# EAGLE design djesaac (EAGLE 8.1.1)
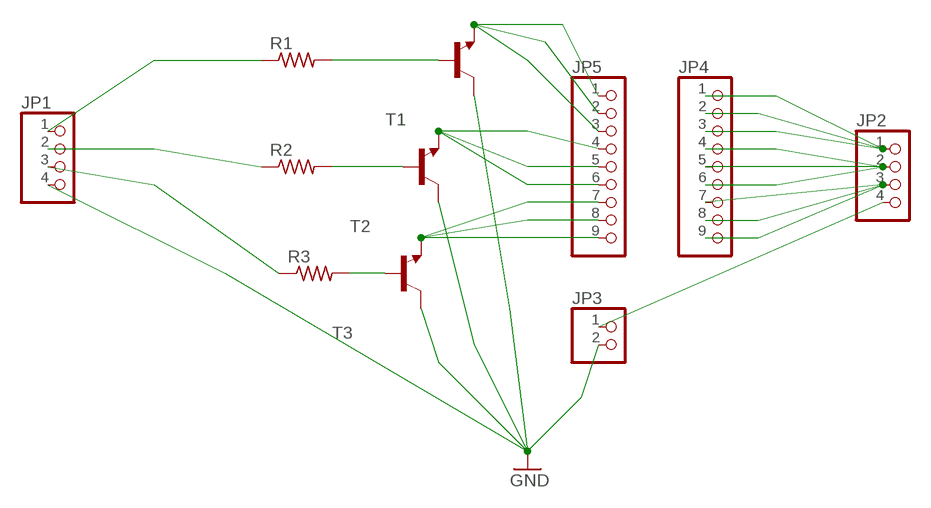
[diagram p0: schematic, sheet 1]

## Parts
JP1  PINHD-1X4  [1X04]
JP2  PINHD-1X4  [1X04]
JP3  PINHD-1X2  [1X02]
JP4  PINHD-1X9  [1X09]
JP5  PINHD-1X9  [1X09]
R1  R-US_0207/10  [0207/10]
R2  R-US_0207/10  [0207/10]
R3  R-US_0207/10  [0207/10]
T1  -NPN-TO92-CBE  [TO92-CBE]
T2  -NPN-TO92-CBE  [TO92-CBE]
T3  -NPN-TO92-CBE  [TO92-CBE]

## Nets
GND: JP1.4 JP3.2 T1.C T2.C T3.C
N$1: JP1.1 R1.1
N$2: JP1.2 R2.1
N$3: JP1.3 R3.1
N$4: JP2.4 JP3.1
N$5: R1.2 T1.B
N$6: R2.2 T2.B
N$7: R3.2 T3.B
N$8: JP5.1 JP5.2 JP5.3 T1.E
N$9: JP5.4 JP5.5 JP5.6 T2.E
N$10: JP5.7 JP5.8 JP5.9 T3.E
N$11: JP2.1 JP4.1 JP4.2 JP4.3
N$12: JP2.2 JP4.4 JP4.5 JP4.6
N$13: JP2.3 JP4.7 JP4.8 JP4.9

## Library data of the parts
JP1 JP2 = pinhead:PINHD-1X4: PIN HEADER
JP3 = pinhead:PINHD-1X2: PIN HEADER
JP4 JP5 = pinhead:PINHD-1X9: PIN HEADER
R1-R3 = resistor:R-US_: RESISTOR, American symbol
T1-T3 = transistor-neu-to92:*-NPN-: NPN Transistror

## Board
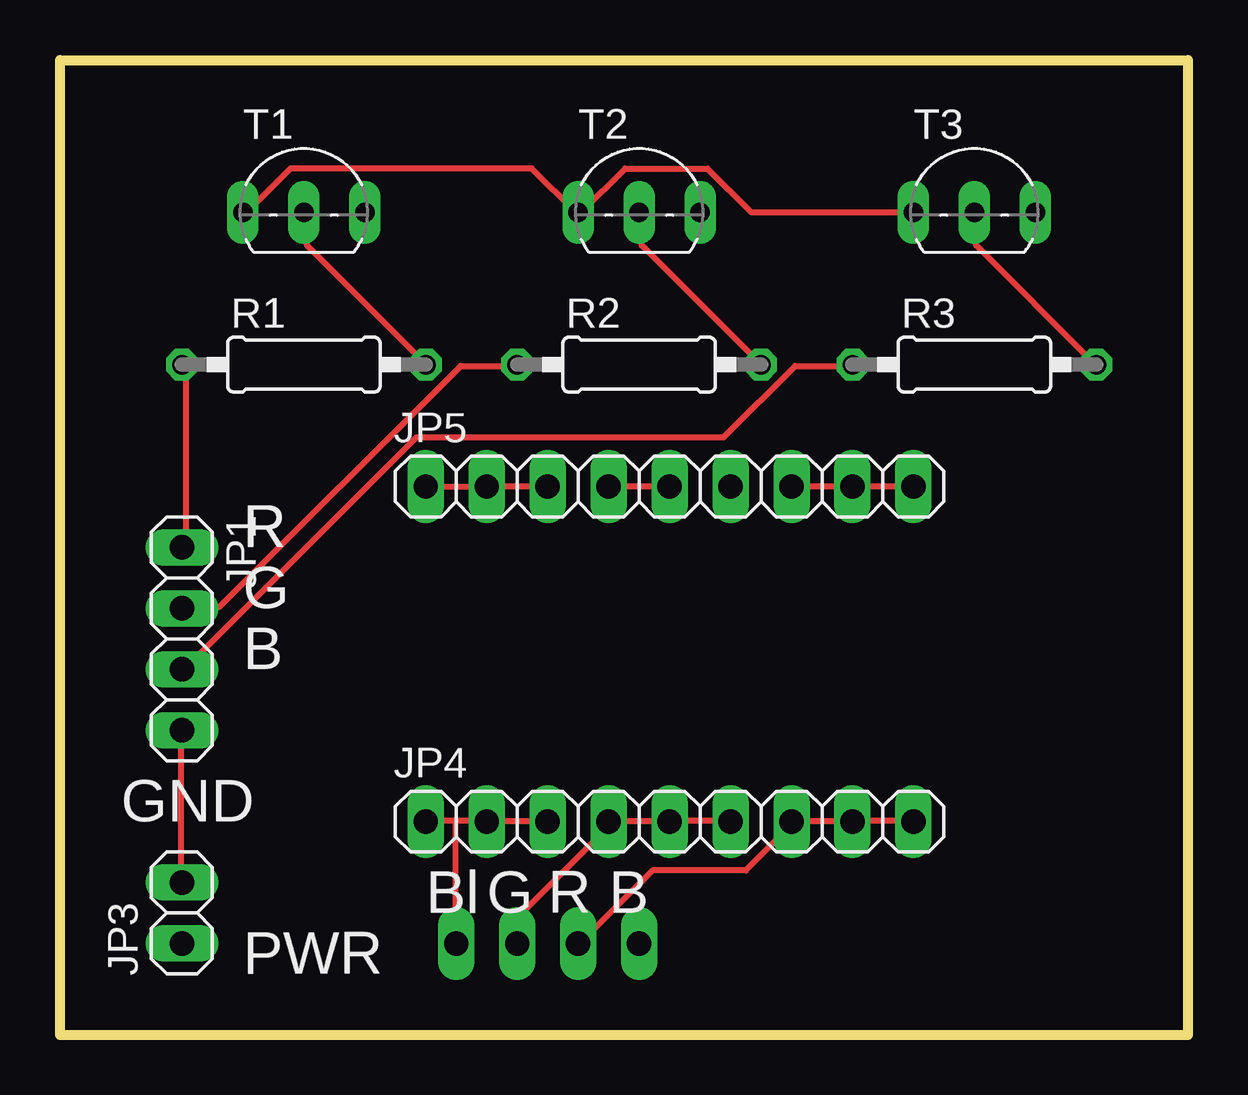
[diagram p1: board, top side]
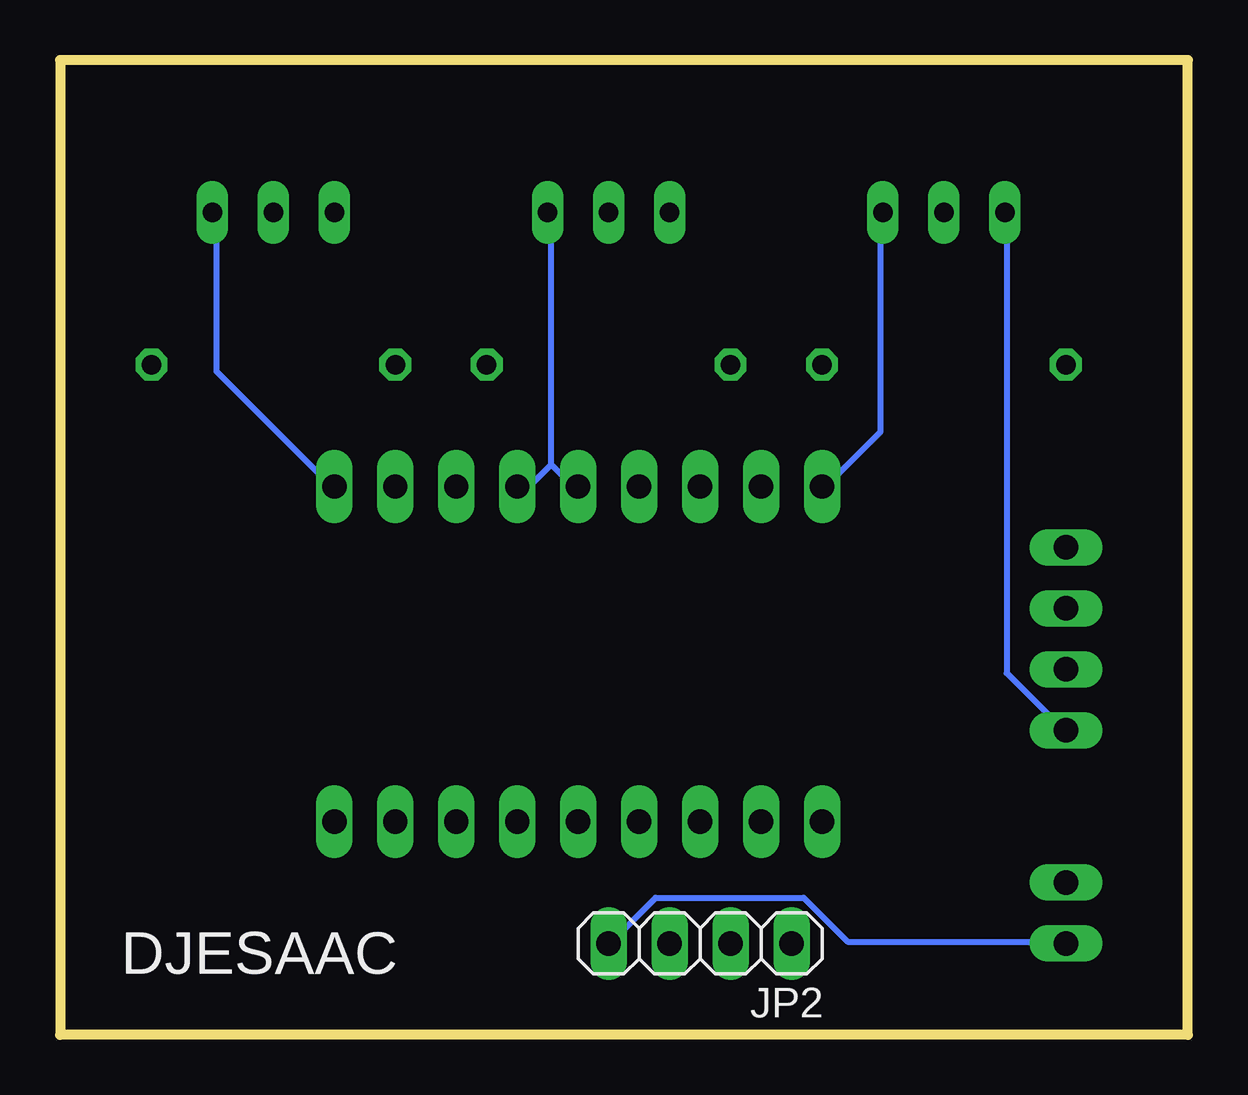
[diagram p2: board, bottom side, seen from below]

Size 46.99 x 40.64 mm. Coordinates in mm from the lower left corner, seen from the top.
Outline: 0,0 0,40.64 46.99,40.64 46.99,0 0,0
Copper layers (1*16): Top 0.035mm / dielectric 1.5mm / Bottom 0.035mm
Design rules "default": minimum track width 10mil, minimum drill 24mil, track to track 8mil, track to pad 8mil, pad to pad 8mil, via to via 8mil, smd to smd 8mil, copper to edge 40mil, drill to drill 8mil, minimum pad ring 10mil, minimum via ring 8mil, stop-mask expansion 4mil, vias tented up to drill 0mil, thermal gap 10mil

### Footprints (pad centres in the part's own frame; a part is rotated, then mirrored left to right if it is on the bottom)
1X04 = drill 1.016 long: 1 -3.81,0; 2 -1.27,0; 3 1.27,0; 4 3.81,0
1X02 = drill 1.016 long: 1 -1.27,0; 2 1.27,0
1X09 = drill 1.016 long: 1 -10.16,0; 2 -7.62,0; 3 -5.08,0; 4 -2.54,0; 5 0,0; 6 2.54,0; 7 5.08,0; 8 7.62,0; 9 10.16,0
0207/10 = drill 0.813 octagon: 1 -5.08,0; 2 5.08,0
TO92-CBE = drill 0.813 long: B 0,0; C -2.54,0; E 2.54,0

### Placement (x,y rotation side)
JP1  5.08,16.51 270 top
JP2  20.32,3.81 180 bottom
JP3  5.08,5.08 90 top
JP4  25.4,8.89 0 top
JP5  25.4,22.86 0 top
R1  10.16,27.94 0 top
R2  24.13,27.94 0 top
R3  38.1,27.94 0 top
T1  10.16,34.29 0 top
T2  24.13,34.29 0 top
T3  38.1,34.29 0 top

### Tracks (layer width: path | path; a pad name or v marks a point on that pad's centre or on a via)
GND
  Top 0.254: JP3.2 5.03,6.4 5.03,12.57 JP1.4 | T1.C 7.77,34.29 9.6,36.12 19.66,36.12 21.49,34.29 T2.C 21.72,34.29 23.55,36.12 26.98,36.12 28.8,34.29 T3.C
  Bottom 0.254: JP1.4 5.26,12.8 7.54,15.09 7.54,34.29 T1.C
N$1
  Top 0.254: R1.1 5.26,27.89 5.26,20.34 JP1.1
N$2
  Top 0.254: R2.1 18.97,27.89 16.69,27.89 6.63,17.83 5.26,17.83 JP1.2
N$3
  Top 0.254: R3.1 32.92,27.89 30.63,27.89 27.66,24.92 14.86,24.92 5.26,15.32 JP1.3
N$4
  Bottom 0.254: JP3.1 5.26,3.89 14.17,3.89 16,5.71 22.17,5.71 24,3.89 JP2.4
N$5
  Top 0.254: T1.B 10.29,34.29 10.29,32.92 15.09,28.12 R1.2
N$6
  Top 0.254: R2.2 24.23,32.92 24.23,34.29 T2.B
N$7
  Top 0.254: T3.B 38.18,34.29 38.18,32.92 42.98,28.12 R3.2
N$8
  Top 0.254: JP5.3 JP5.2 JP5.1
  Bottom 0.254: T1.E 12.8,34.29 12.8,25.15 15.09,22.86 JP5.1
N$9
  Top 0.254: JP5.5 JP5.4
  Bottom 0.254: 26.52,23.77 26.52,34.29 T2.E | 26.52,23.77 25.6,22.86 JP5.5 | JP5.6 27.43,22.86 26.52,23.77
N$10
  Top 0.254: JP5.7 JP5.8 JP5.9
  Bottom 0.254: T3.E 40.46,34.29 40.46,27.66 35.66,22.86 JP5.9
N$11
  Top 0.254: 16.46,8.91 17.6,8.91 JP4.2 17.83,8.91 20.12,8.91 JP4.3 | 16.46,8.91 15.32,8.91 JP4.1 | 16.46,8.91 16.46,3.89 JP2.1
N$12
  Top 0.254: JP4.6 27.89,8.91 25.6,8.91 JP4.5 25.38,8.91 22.86,8.91 JP4.4 22.86,8.69 19.2,5.03 19.2,3.89 JP2.2
N$13
  Top 0.254: JP4.9 35.43,8.91 33.15,8.91 JP4.8 32.92,8.91 30.63,8.91 JP4.7 30.4,8.69 28.57,6.86 24.69,6.86 21.72,3.89 JP2.3

### Text on the board
tPlace: R | R | G | B | GND | Bl | G | R | B | PWR
bPlace: DJESAAC